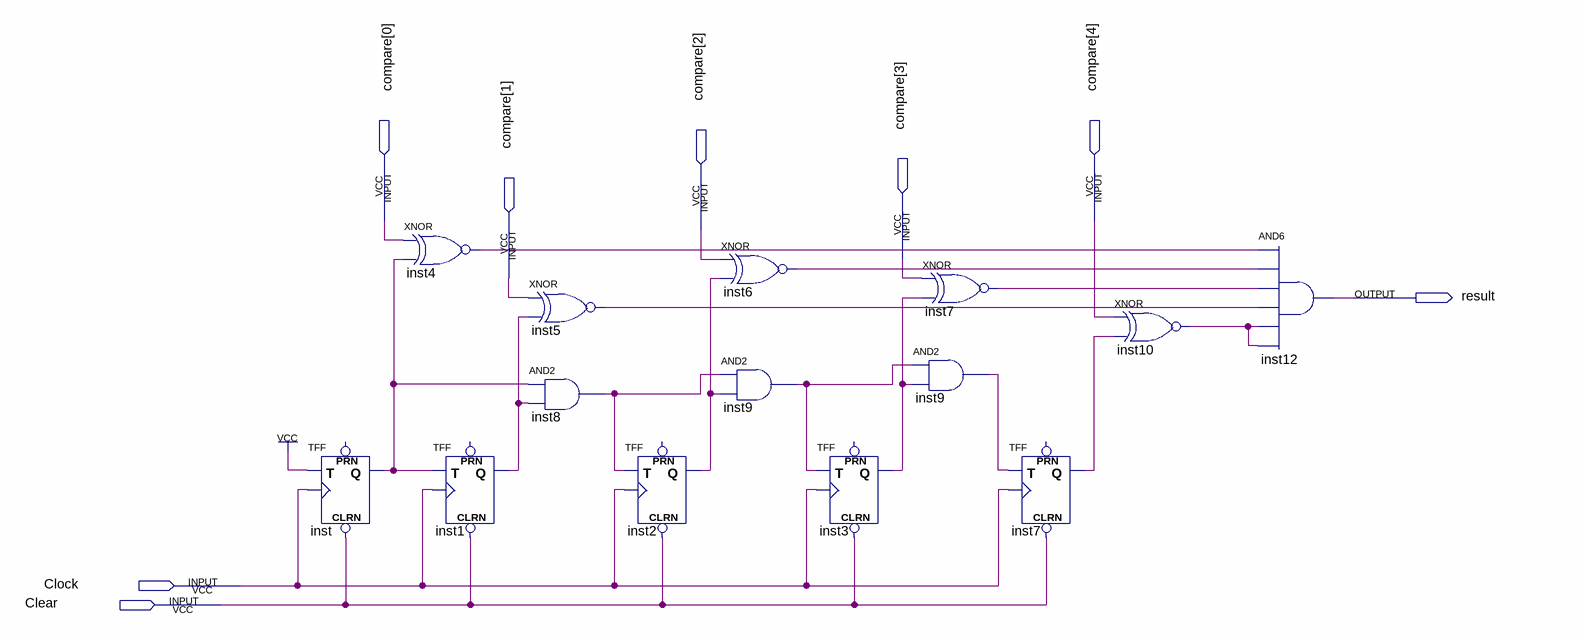
[diagram p0: schematic sheet]
// Quartus schematic counterCompare.bdf as structural Verilog: 14 symbols, 8 pins
module counterCompare (
  input  [4:0] compare,
  input  Clock,
  input  Clear,
  output result
);

  wire inst1_q, inst2_q, inst3_q, inst4_out, inst5_out, inst6_out, inst7_out, inst7_q, inst8_out, inst9_out,
       inst9_out_2, inst10_out, inst_q;

  TFF inst (.CLRN(Clear), .T(1'b1), .CLK(Clock), .Q(inst_q));  // open: PRN
  xnor inst4 (inst4_out, compare[0], inst_q);
  TFF inst1 (.CLRN(Clear), .T(inst_q), .CLK(Clock), .Q(inst1_q));  // open: PRN
  xnor inst5 (inst5_out, compare[1], inst1_q);
  and inst8 (inst8_out, inst_q, inst1_q);
  TFF inst2 (.CLRN(Clear), .T(inst8_out), .CLK(Clock), .Q(inst2_q));  // open: PRN
  xnor inst6 (inst6_out, compare[2], inst2_q);
  and inst9 (inst9_out, inst8_out, inst2_q);
  TFF inst3 (.CLRN(Clear), .T(inst9_out), .CLK(Clock), .Q(inst3_q));  // open: PRN
  xnor inst7 (inst7_out, compare[3], inst3_q);
  and inst9_dup2 (inst9_out_2, inst9_out, inst3_q);
  TFF inst7_dup2 (.CLRN(Clear), .T(inst9_out_2), .CLK(Clock), .Q(inst7_q));  // open: PRN
  xnor inst10 (inst10_out, compare[4], inst7_q);
  and inst12 (result, inst4_out, inst6_out, inst7_out, inst5_out, inst10_out, inst10_out);
endmodule
